# Altium schematic sheet koosh_power.SchDoc
size A
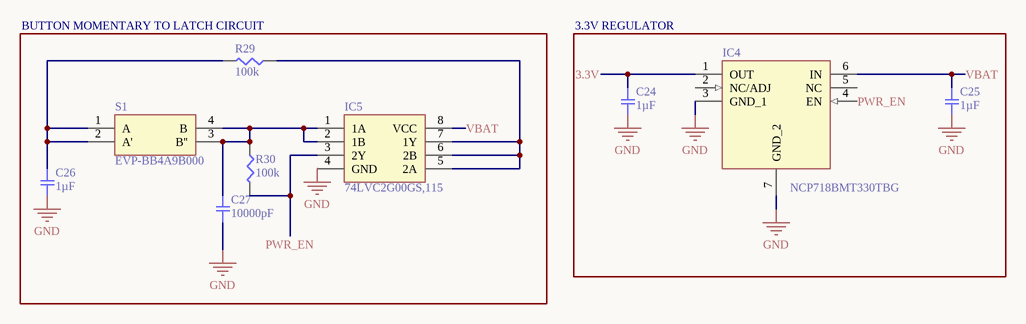
[diagram p0: koosh_power.SchDoc]

## Parts
C24  1µF  [SMD-0402C]
C25  1µF  [SMD-0402C]
C26  1µF  [SMD-0402C]
C27  10000pF  [SMD-0402C]
IC4  NCP718BMT330TBG  [SON65P200X200X80-7N]
IC5  74LVC2G00GS,115  [74AXP2T3407GSX]
R29  100k  [SMD-0402-RES]
R30  100k  [SMD-0402-RES]
S1  EVP-BB4A9B000  [EVPBB2A9B000]

## Blocks framed on the sheet
BUTTON MOMENTARY TO LATCH CIRCUIT: C26 C27 IC5 R29 R30 S1
3.3V REGULATOR: C24 C25 IC4

## Nets
GND: C24.2 C25.2 C26.2 C27.1 IC4.3(GND_1) IC4.7(GND_2) IC5.4(GND)
3.3V: C24.1 IC4.1(OUT)
PWR_EN: IC4.4(EN) IC5.3(2Y) R30.2
VBAT: C25.1 IC4.6(IN) IC5.8(VCC)
NetC26_1: C26.1 R29.2 S1.1(A) S1.2(A')
NetC27_2: C27.2 IC5.1(1A) IC5.2(1B) R30.1 S1.3(B'') S1.4(B)
NetIC5_5: IC5.5(2A) IC5.6(2B) IC5.7(1Y) R29.1

Not connected (* = marked no-connect by the designer): IC4 2(NC/ADJ) 5(NC)

## Library data of the parts
C24-C26 = GCM155C71A105KE38D: CAP CER 1UF 10V X7S 0402; Manufacturer: Murata Electronics North America; Factory Stock: 0; Unit Price (USD): 0.12; Minimum Quantity: 1; Tolerance: ±10%; Datasheets: http://www.murata.com/~/media/webrenewal/support/library/catalog/products/capacitor/mlcc/c03e.ashx; Image: //media.digikey.com/Renders/Murata%20Renders/ZRB-SERIES-0402.jpg; Digi-Key Part Number: 490-13409-1-ND; Part Number: GCM155C71A105KE38D; Quantity Available: 7240; @ qty: 0; Packaging: Cut Tape (CT); Series: GCM; Part Status: Active; Value: 1µF; Voltage: 10V; Temperature Coefficient: X7S; Operating Temperature: -55°C ~ 125°C; Features: -; Ratings: AEC-Q200; Applications: Automotive; Mounting Type: Surface Mount, MLCC; Package / Case: 0402 (1005 Metric); Size / Dimension: 0.039" L x 0.020" W (1.00mm x 0.50mm); Height - Seated (Max): -; Thickness (Max): 0.022" (0.55mm); Lead Spacing: -; Lead Style: -
C27 = GCM155R71H103KA55D: CAP CER 10000PF 50V X7R 0402; Manufacturer: Murata Electronics North America; Factory Stock: 0; Unit Price (USD): 0.1; Minimum Quantity: 1; Tolerance: ±10%; Datasheets: http://www.murata.com/~/media/webrenewal/support/library/catalog/products/capacitor/mlcc/c03e.ashx; Image: //media.digikey.com/Renders/Murata%20Renders/ZRB-SERIES-0402.jpg; Digi-Key Part Number: 490-4762-1-ND; Part Number: GCM155R71H103KA55D; Quantity Available: 650067; @ qty: 0; Packaging: Cut Tape (CT); Series: GCM; Part Status: Active; Value: 10000pF; Voltage: 50V; Temperature Coefficient: X7R; Operating Temperature: -55°C ~ 125°C; Features: -; Ratings: AEC-Q200; Applications: Automotive; Mounting Type: Surface Mount, MLCC; Package / Case: 0402 (1005 Metric); Size / Dimension: 0.039" L x 0.020" W (1.00mm x 0.50mm); Height - Seated (Max): -; Thickness (Max): 0.022" (0.55mm); Lead Spacing: -; Lead Style: -
IC4 = NCP718BMT330TBG: Integrated Circuit; Manufacturer_Name: ON Semiconductor; Datasheet Link: https://componentsearchengine.com/Datasheets/1/NCP718BMT330TBG.pdf; Height: 0.8mm; Manufacturer_Part_Number: NCP718BMT330TBG; Mouser Part Number: 863-NCP718BMT330TBG; Mouser Price/Stock: https://www.mouser.com/Search/Refine.aspx?Keyword=863-NCP718BMT330TBG; RS Part Number: 1861278; RS Price/Stock: http://uk.rs-online.com/web/p/products/1861278
IC5 = 74LVC2G00GS,115: Integrated Circuit; Manufacturer_Name: Nexperia; Datasheet Link: https://assets.nexperia.com/documents/data-sheet/74LVC2G00.pdf; Height: 0.35mm; Manufacturer_Part_Number: 74LVC2G00GS,115
R29 R30 = ERJ-2GEJ104X: RES SMD 100K OHM 5% 1/10W 0402; Manufacturer: Panasonic Electronic Components; Factory Stock: 0; Unit Price (USD): 0.00350; @ qty: 1500; Minimum Quantity: 1; Power (Watts): 0.1W, 1/10W; Temperature Coefficient: ±200ppm/°C; Part Number: ERJ-2GEJ104X; Datasheets: http://industrial.panasonic.com/www-cgi/jvcr13pz.cgi?E+PZ+3+AOA0001+ERJ2GEJ104X+7+WW; Image: //media.digikey.com/Photos/Panasonic%20Photos/ERJ-PA2-Series.jpg; Digi-Key Part Number: P100KJCT-ND; Quantity Available: 2387986; Packaging: Cut Tape (CT); Series: ERJ; Part Status: Active; Value: 100k; Tolerance: ±5%; Composition: Thick Film; Features: Automotive AEC-Q200; Operating Temperature: -55°C ~ 155°C; Package / Case: 0402 (1005 Metric); Supplier Device Package: 0402; Size / Dimension: 0.039" L x 0.020" W (1.00mm x 0.50mm); Height - Seated (Max): 0.016" (0.40mm); Number of Terminations: 2; Failure Rate: -
S1 = EVP-BB4A9B000: Switch; Manufacturer_Name: Panasonic; Datasheet Link: https://industrial.panasonic.com/ac/cdn/e/control/switch/light-touch/catalog/sw_lt_eng_2616s.pdf; Height: 0mm; Manufacturer_Part_Number: EVP-BB4A9B000; Mouser Part Number: 667-EVP-BB4A9B000; Mouser Price/Stock: https://www.mouser.com/Search/Refine.aspx?Keyword=667-EVP-BB4A9B000